# EAGLE design alt (EAGLE 6.5.0)
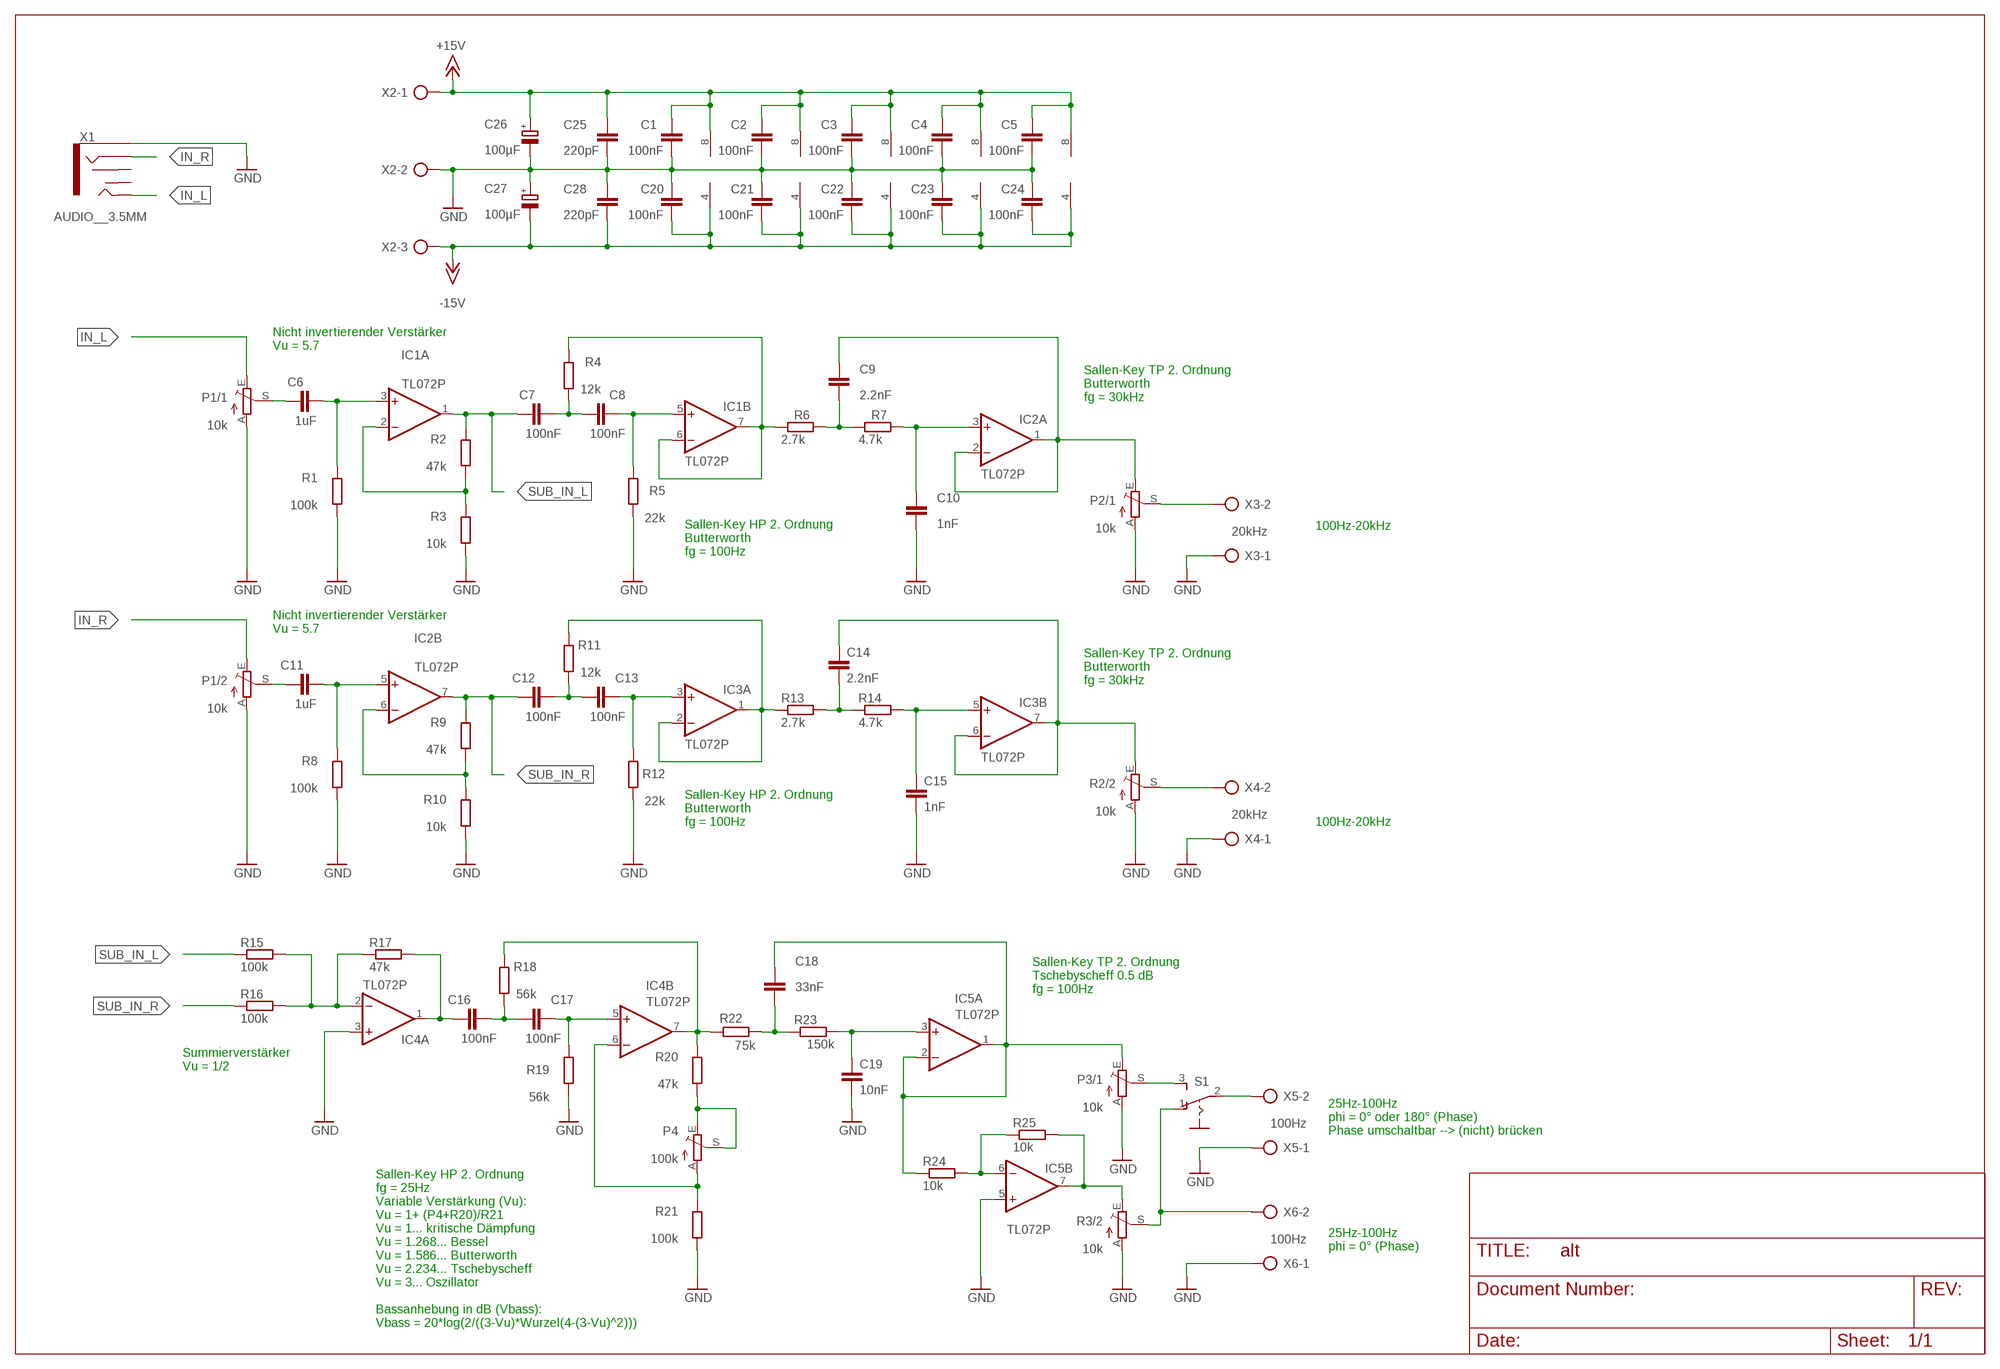
[diagram p0: schematic, sheet 1]

## Parts
C1  100nF  C-EU025-025X050  [C025-025X050]
C2  100nF  C-EU025-025X050  [C025-025X050]
C3  100nF  C-EU025-025X050  [C025-025X050]
C4  100nF  C-EU025-025X050  [C025-025X050]
C5  100nF  C-EU025-025X050  [C025-025X050]
C6  1uF  C-EU025-025X050  [C025-025X050]
C7  100nF  C-EU025-025X050  [C025-025X050]
C8  100nF  C-EU025-025X050  [C025-025X050]
C9  2.2nF  C-EU025-025X050  [C025-025X050]
C10  1nF  C-EU025-025X050  [C025-025X050]
C11  1uF  C-EU025-025X050  [C025-025X050]
C12  100nF  C-EU025-025X050  [C025-025X050]
C13  100nF  C-EU025-025X050  [C025-025X050]
C14  2.2nF  C-EU025-025X050  [C025-025X050]
C15  1nF  C-EU025-025X050  [C025-025X050]
C16  100nF  C-EU050-025X075  [C050-025X075]
C17  100nF  C-EU025-025X050  [C025-025X050]
C18  33nF  C-EU025-025X050  [C025-025X050]
C19  10nF  C-EU025-025X050  [C025-025X050]
C20  100nF  C-EU025-025X050  [C025-025X050]
C21  100nF  C-EU025-025X050  [C025-025X050]
C22  100nF  C-EU025-025X050  [C025-025X050]
C23  100nF  C-EU025-025X050  [C025-025X050]
C24  100nF  C-EU025-025X050  [C025-025X050]
C25  220pF  C-EU025-025X050  [C025-025X050]
C26  100µF  CPOL-EUE2.5-6  [E2,5-6]
C27  100µF  CPOL-EUE2.5-6  [E2,5-6]
C28  220pF  C-EU025-025X050  [C025-025X050]
IC1  TL072P  [DIL08]
IC2  TL072P  [DIL08]
IC3  TL072P  [DIL08]
IC4  TL072P  [DIL08]
IC5  TL072P  [DIL08]
P1/1  10k  TRIM_EU-B64Y  [B64Y]
P1/2  10k  TRIM_EU-B64Y  [B64Y]
P2/1  10k  TRIM_EU-B64Y  [B64Y]
P3/1  10k  TRIM_EU-B64Y  [B64Y]
P4  100k  TRIM_EU-B64Y  [B64Y]
R1  100k  R-EU_0207/10  [0207/10]
R2  47k  R-EU_0207/10  [0207/10]
R2/2  10k  TRIM_EU-B64Y  [B64Y]
R3  10k  R-EU_0207/10  [0207/10]
R3/2  10k  TRIM_EU-B64Y  [B64Y]
R4  12k  R-EU_0207/10  [0207/10]
R5  22k  R-EU_0207/10  [0207/10]
R6  2.7k  R-EU_0207/10  [0207/10]
R7  4.7k  R-EU_0207/10  [0207/10]
R8  100k  R-EU_0207/7  [0207/7]
R9  47k  R-EU_0207/7  [0207/7]
R10  10k  R-EU_0207/10  [0207/10]
R11  12k  R-EU_0207/10  [0207/10]
R12  22k  R-EU_0207/10  [0207/10]
R13  2.7k  R-EU_0207/10  [0207/10]
R14  4.7k  R-EU_0207/10  [0207/10]
R15  100k  R-EU_0207/10  [0207/10]
R16  100k  R-EU_0207/10  [0207/10]
R17  47k  R-EU_0207/10  [0207/10]
R18  56k  R-EU_0207/10  [0207/10]
R19  56k  R-EU_0207/7  [0207/7]
R20  47k  R-EU_0207/10  [0207/10]
R21  100k  R-EU_0207/10  [0207/10]
R22  75k  R-EU_0207/7  [0207/7]
R23  150k  R-EU_0207/10  [0207/10]
R24  10k  R-EU_0207/10  [0207/10]
R25  10k  R-EU_0207/10  [0207/10]
S1  255SB  [255SB]
X1  AUDIO__3.5MM  AUDIO_JACK_3.5MM_PTH  [AUDIO-JACK]
X2  AK300/3  [AK300/3]
X3  20kHz  AK300/2  [AK300/2]
X4  20kHz  AK300/2  [AK300/2]
X5  100Hz  AK300/2  [AK300/2]
X6  100Hz  AK300/2  [AK300/2]

## Nets
+15V: C1.1 C2.1 C3.1 C4.1 C5.1 C25.1 C26.+ IC1.8(P:V+) IC2.8(P:V+) IC3.8(P:V+) IC4.8(P:V+) IC5.8(P:V+) X2.1
-15V: C20.2 C21.2 C22.2 C23.2 C24.2 C27.- C28.2 IC1.4(P:V-) IC2.4(P:V-) IC3.4(P:V-) IC4.4(P:V-) IC5.4(P:V-) X2.3
GND: C1.2 C2.2 C3.2 C4.2 C5.2 C10.2 C15.2 C19.2 C20.1 C21.1 C22.1 C23.1 C24.1 C25.2 C26.- C27.+ C28.1 IC4.3(A:+IN) IC5.5(B:+IN) P1/1.A P1/2.A P2/1.A P3/1.A R1.1 R2/2.A R3.1 R3/2.A R5.1 R8.1 R10.1 R12.1 R19.1 R21.1 X1.SLEEVE X2.2 X3.1 X4.1 X5.1 X6.1
IN_L: P1/1.E X1.TIP
IN_R: P1/2.E X1.RING
N$1: P3/1.S S1.3(S)
N$2: R3/2.S S1.1(O) X6.2
N$3: S1.2(P) X5.2
N$26: C6.1 P1/1.S
N$28: C6.2 IC1.3(A:+IN) R1.2
N$31: IC1.2(A:-IN) R2.1 R3.2
N$33: IC1.6(B:-IN) IC1.7(B:OUT) R4.2 R6.1
N$34: C8.2 IC1.5(B:+IN) R5.2
N$35: C7.2 C8.1 R4.1
N$36: IC4.2(A:-IN) R15.2 R16.2 R17.1
N$37: C9.2 R6.2 R7.1
N$38: C10.1 IC2.3(A:+IN) R7.2
N$39: C9.1 IC2.1(A:OUT) IC2.2(A:-IN) P2/1.E
N$40: C16.1 IC4.1(A:OUT) R17.2
N$41: C11.1 P1/2.S
N$42: C11.2 IC2.5(B:+IN) R8.2
N$43: IC2.6(B:-IN) R9.1 R10.2
N$45: IC3.1(A:OUT) IC3.2(A:-IN) R11.2 R13.1
N$46: C13.2 IC3.3(A:+IN) R12.2
N$47: C12.2 C13.1 R11.1
N$48: C14.2 R13.2 R14.1
N$49: C15.1 IC3.5(B:+IN) R14.2
N$50: C14.1 IC3.6(B:-IN) IC3.7(B:OUT) R2/2.E
N$51: C16.2 C17.1 R18.1
N$52: C17.2 IC4.5(B:+IN) R19.2
N$53: IC4.7(B:OUT) R18.2 R20.2 R22.2
N$54: IC4.6(B:-IN) P4.A R21.2
N$55: IC5.6(B:-IN) R24.2 R25.1
N$57: P4.E P4.S R20.1
N$59: C19.1 IC5.3(A:+IN) R23.2
N$60: C18.2 R22.1 R23.1
OUT_L: P2/1.S X3.2
OUT_R: R2/2.S X4.2
SUB_IN_L: C7.1 IC1.1(A:OUT) R2.2 R15.1
SUB_IN_R: C12.1 IC2.7(B:OUT) R9.2 R16.1
SUB_OUT: IC5.7(B:OUT) R3/2.E R25.2
SUB_OUT-180: C18.1 IC5.1(A:OUT) IC5.2(A:-IN) P3/1.E R24.1
Unconnected: X1.RSH X1.TSH

## Notes on the sheet
- Nicht invertierender Verstärker
  Vu = 5.7
- Sallen-Key TP 2. Ordnung
  Butterworth
  fg = 30kHz
- 100Hz-20kHz
- Sallen-Key HP 2. Ordnung
  Butterworth
  fg = 100Hz
- Nicht invertierender Verstärker
  Vu = 5.7
- Sallen-Key TP 2. Ordnung
  Butterworth
  fg = 30kHz
- Sallen-Key HP 2. Ordnung
  Butterworth
  fg = 100Hz
- 100Hz-20kHz
- Sallen-Key TP 2. Ordnung
  Tschebyscheff 0.5 dB
  fg = 100Hz
- Summierverstärker
  Vu = 1/2
- 25Hz-100Hz
  phi = 0° oder 180° (Phase) 
  Phase umschaltbar --> (nicht) brücken
- 25Hz-100Hz
  phi = 0° (Phase)
- Sallen-Key HP 2. Ordnung
  fg = 25Hz
  Variable Verstärkung (Vu): 
  Vu = 1+ (P4+R20)/R21
  Vu = 1... kritische Dämpfung
  Vu = 1.268... Bessel
  Vu = 1.586... Butterworth
  Vu = 2.234... Tschebyscheff
  Vu = 3... Oszillator
  
  Bassanhebung in dB (Vbass):
  Vbass = 20*log(2/((3-Vu)*Wurzel(4-(3-Vu)^2)))

## Library data of the parts
C1-C5 C16-C25 C28 = rcl:C-EU: CAPACITOR, European symbol
C6-C15 = resistor:C-EU: CAPACITOR, European symbol
C26 C27 = rcl:CPOL-EU: POLARIZED CAPACITOR, European symbol
IC1-IC5 = linear:TL072: OP AMP
P1/1 P1/2 P2/1 P3/1 P4 R2/2 R3/2 = pot:TRIM_EU-: POTENTIOMETER
R1-R7 R10-R14 = resistor:R-EU_: RESISTOR, European symbol
R8 R9 R15-R25 = rcl:R-EU_: RESISTOR, European symbol
S1 = switch:255SB: SLIDING SWITCH Distributor Buerklin, 11G810
X1 = SparkFun-Connectors:AUDIO_JACK_3.5MM: Audio Jack 3.5mm variants of PTH and SMT stereo audio jack with bypass switches. SparkFun Products: SparkFun SparkPunk Sound Kit <[https://www.sparkfun.com/products/11177]> - PTH MP3 Trigger <https://www.sparkfun.com/products/13720> -3.5mm SMD SparkFun PicoBoard <https://www.sparkfun.com/products/11888>- 2.5mm SMD; PROD_ID: CONN-08774; SF_ID: PRT-08032
X2 = con-ptr500:AK300/3: CONNECTOR; OC_FARNELL: unknown; OC_NEWARK: unknown
X3-X6 = con-ptr500:AK300/2: CONNECTOR; OC_FARNELL: unknown; OC_NEWARK: unknown

## Board
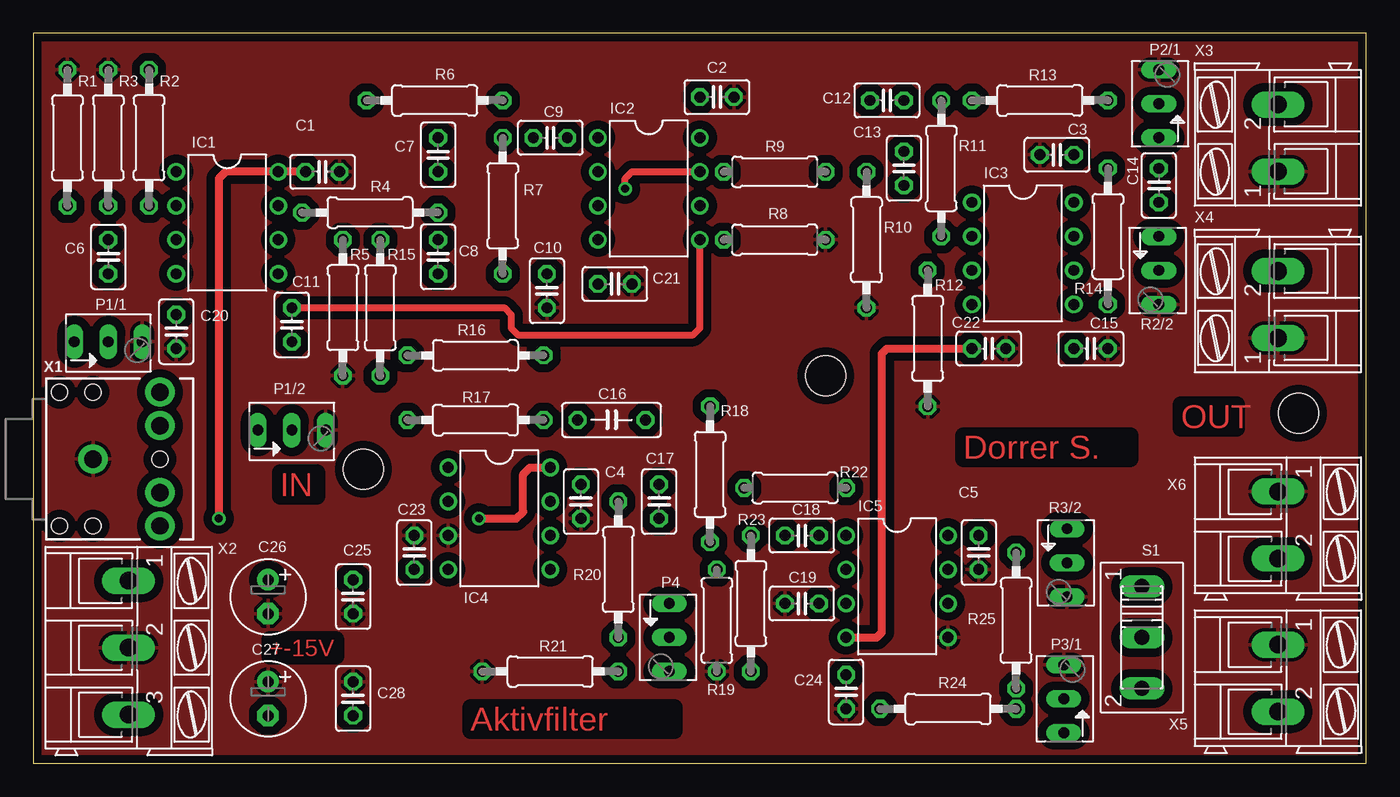
[diagram p1: board, top side]
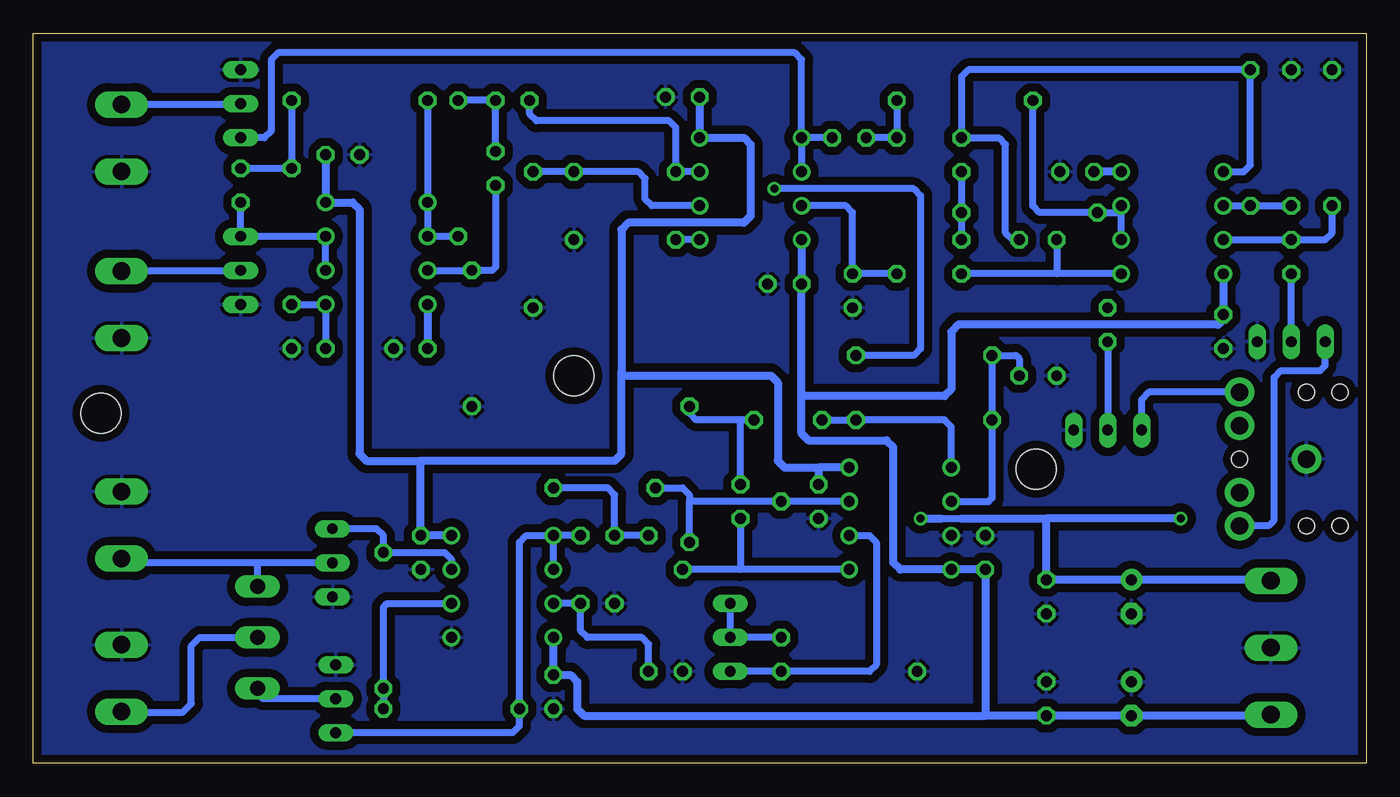
[diagram p2: board, bottom side, seen from below]

Size 99.55 x 54.53 mm. Coordinates in mm from the lower left corner, seen from the top.
Outline: 0,0 99.55,0 99.55,54.53 0,54.53 0,0
Copper layers (1*16): Top 0.035mm / dielectric 1.5mm / Bottom 0.035mm
Design rules "default *": minimum track width 10mil, minimum drill 20mil, track to track 8mil, track to pad 8mil, pad to pad 8mil, via to via 8mil, smd to smd 8mil, copper to edge 20mil, drill to drill 8mil, minimum pad ring 10mil, minimum via ring 8mil, stop-mask expansion 4mil, vias tented up to drill 0mil, thermal gap 10mil
Holes 3 mm at 59.18,28.96 24.64,21.97 94.49,26.16

### Footprints (pad centres in the part's own frame; a part is rotated, then mirrored left to right if it is on the bottom)
C025-025X050 = drill 0.813 octagon: 1 -1.27,0; 2 1.27,0
C050-025X075 = drill 0.813 octagon: 1 -2.54,0; 2 2.54,0
E2,5-6 = drill 0.813 pad 1.6: + -1.27,0 | drill 0.813 pad 1.6 octagon: - 1.27,0
DIL08 = drill 0.813 pad 1.27: 1 -3.81,-3.81; 2 -1.27,-3.81; 3 1.27,-3.81; 4 3.81,-3.81; 5 3.81,3.81; 6 1.27,3.81; 7 -1.27,3.81; 8 -3.81,3.81
B64Y = drill 0.813 long: A 2.54,0; E -2.54,0; S 0,0
0207/10 = drill 0.813 octagon: 1 -5.08,0; 2 5.08,0
0207/7 = drill 0.813 octagon: 1 -3.81,0; 2 3.81,0
255SB = drill 1.118 long: 1 -3.81,0; 2 0,0; 3 3.81,0
AUDIO-JACK = drill 1.3 pad 2.184: RING 5,5; RSH 5,2.5; SLEEVE 0,0; TIP 5,-5; TSH 5,-2.5 | hole 1.2: 0,5; -2.5,5; -2.5,-5; 0,-5; 5,0
AK300/3 = drill 1.321 long: 1 -5.004,0; 2 0,0; 3 5.004,0
AK300/2 = drill 1.321 long: 1 -2.515,0; 2 2.489,0

### Placement (x,y rotation side)
C1  21.59,44.2 0 top
C2  51.05,49.78 0 top
C3  76.45,45.47 180 top
C4  40.89,19.56 270 top
C5  70.61,15.75 270 top
C6  5.59,37.85 90 top
C7  30.23,45.47 270 top
C8  30.23,37.85 270 top
C9  38.61,46.74 180 top
C10  38.35,35.31 270 top
C11  19.3,32.77 90 top
C12  63.75,49.53 0 top
C13  65.02,44.45 270 top
C14  84.07,43.18 90 top
C15  78.99,30.99 0 top
C16  43.18,25.65 0 top
C17  46.74,19.56 270 top
C18  57.4,17.02 180 top
C19  57.4,11.94 180 top
C20  10.67,32.26 90 top
C21  43.43,35.81 180 top
C22  71.37,30.99 180 top
C23  28.45,15.75 270 top
C24  60.71,5.33 90 top
C25  23.88,12.45 270 top
C26  17.53,12.45 270 top
C27  17.53,4.83 270 top
C28  23.88,4.83 270 top
IC1  14.48,40.39 270 top
IC2  45.97,42.93 270 top
IC3  73.91,38.1 270 top
IC4  34.8,18.29 270 top
IC5  64.52,13.21 270 top
P1/1  5.59,31.5 0 top
P1/2  19.3,24.89 0 top
P2/1  84.07,49.28 90 top
P3/1  76.96,4.83 90 top
P4  47.5,9.4 270 top
R1  2.54,46.74 270 top
R2  8.64,46.74 90 top
R2/2  84.07,36.83 270 top
R3  5.59,46.74 270 top
R3/2  77.22,14.99 270 top
R4  25.15,41.15 180 top
R5  23.11,34.04 90 top
R6  29.97,49.53 0 top
R7  35.05,41.66 270 top
R8  55.37,39.12 180 top
R9  55.37,44.2 180 top
R10  62.23,39.12 90 top
R11  67.82,44.45 270 top
R12  66.8,31.75 90 top
R13  75.18,49.53 0 top
R14  80.26,39.37 270 top
R15  25.91,34.04 270 top
R16  33.02,30.48 180 top
R17  33.02,25.65 0 top
R18  50.55,21.59 270 top
R19  51.05,10.67 90 top
R20  43.69,14.48 90 top
R21  38.61,6.86 0 top
R22  56.9,20.57 180 top
R23  53.59,11.94 270 top
R24  68.33,4.06 0 top
R25  73.41,10.67 90 top
S1  82.8,9.4 270 top
X1  4.45,22.73 0 top
X2  7.11,8.64 270 top
X3  92.96,46.74 90 top
X4  92.96,34.29 90 top
X5  92.96,6.35 270 top
X6  92.96,17.78 270 top

### Tracks (layer width: path | path; a pad name or v marks a point on that pad's centre or on a via)
+15V  (via drill 0.6)
  Top 0.61: IC4.8 37.08,22.1 36.58,21.59 36.58,18.8 36.07,18.29 v33.27,18.29 | C1.1 14.35,44.2 13.84,43.69 v13.84,18.29
  Bottom 0.508: 31.75,18.29 30.23,18.29
  Bottom 0.61: IC5.8 C5.1 70.61,22.61 | C3.1 IC3.8 75.69,41.91 75.18,41.4 75.18,23.11 74.68,22.61 70.61,22.61 | IC1.8 C1.1 | C2.1 IC2.8 46.48,46.74 45.97,46.23 45.97,40.89 46.48,40.39 55.12,40.39 55.63,39.88 55.63,29.21 | 70.61,22.61 56.13,22.61 55.63,23.11 55.63,29.21 | IC4.8 40.89,22.1 | 40.89,22.1 C4.1 | 55.63,29.21 55.37,28.96 44.45,28.96 43.94,28.45 43.94,22.61 43.43,22.1 40.89,22.1 | 23.88,18.29 C25.1 C26.+ 7.19,13.72 X2.1 | v13.84,18.29 23.88,18.29 | v33.27,18.29 31.75,18.29 | 30.23,18.29 23.88,18.29
-15V
  Top 0.61: IC5.4 62.99,9.4 63.37,9.78 63.37,30.61 63.75,30.99 C22.2
  Bottom 0.61: IC5.4 C24.2 59.44,6.6 58.93,6.1 58.93,4.06 58.42,3.56 28.45,3.56 | IC3.4 C22.2 | IC1.4 C20.2 10.67,33.15 11.05,32.77 30.48,32.77 30.99,32.26 30.99,27.94 31.5,27.43 42.16,27.43 | IC2.4 C21.2 42.16,27.43 | 28.45,3.56 C23.2 IC4.4 34.8,14.48 35.31,14.99 35.31,23.62 35.81,24.13 41.66,24.13 42.16,24.64 42.16,27.43 | 28.45,3.56 C28.2 C27.- 7.19,3.56 X2.3
GND
  pour Bottom (isolate 0.61): 0,0 0,54.61 99.57,54.61 99.57,0
  pour Top (isolate 0.61): 0,0 0,54.61 99.57,54.61 99.57,0
IN_L
  Bottom 0.508: X1.TIP 9.4,17.78 7.24,17.78 6.86,18.16 6.86,28.83 6.35,29.34 3.43,29.34 3.05,29.72 P1/1.E
IN_R
  Bottom 0.508: P1/2.E 16.76,27.18 16.18,27.76 9.45,27.76 X1.RING
N$1
  Bottom 0.508: P3/1.S 82.42,4.83 82.8,5.21 S1.3
N$2
  Bottom 0.508: R3/2.S 82.8,14.99 | 82.8,14.99 92.66,14.99 X6.2 | S1.1 82.8,14.99
N$3
  Bottom 0.508: X5.2 92.91,3.81 88.39,3.81 87.76,4.45 87.76,8.76 87.12,9.4 S1.2
N$26
  Bottom 0.508: P1/1.S C6.1
N$28
  Bottom 0.508: IC1.3 C6.2 3.05,39.12 2.54,39.62 R1.2
N$31
  Bottom 0.508: IC1.2 R2.1 R3.2
N$33
  Bottom 0.508: IC1.6 18.29,41.15 | 18.29,41.15 IC1.7 | 18.29,41.15 R4.2 24.38,41.15 24.89,41.66 R6.1
N$34
  Bottom 0.508: IC1.5 23.11,36.58 | 23.11,36.58 C8.2 | R5.2 23.11,36.58
N$35
  Bottom 0.508: C7.2 R4.1 C8.1
N$36
  Bottom 0.508: IC4.2 28.19,19.56 27.94,19.81 R17.1 R16.2 26.16,30.48 25.91,30.23 R15.2
N$37
  Bottom 0.508: R6.2 R7.1 C9.2
N$38
  Bottom 0.508: IC2.3 38.86,41.66 38.35,41.15 C10.1 R7.2
N$39
  Bottom 0.508: C9.1 IC2.1 | IC2.1 IC2.2 | IC2.1 42.16,52.58 42.67,53.09 81.28,53.09 81.79,52.58 81.79,47.24 82.3,46.74 P2/1.E
N$40
  Bottom 0.508: IC4.1 30.99,25.15 31.5,25.65 R17.2 C16.1
N$41
  Bottom 0.508: C11.1 P1/2.S
N$42
  Top 0.508: C11.2 35.18,34.04 35.69,33.53 35.69,32.51 36.2,32 49.28,32 49.78,32.51 IC2.5
  Bottom 0.508: IC2.5 R8.2
N$43
  Bottom 0.508: IC2.6 53.34,41.66 53.85,42.16 53.85,43.69 54.36,44.2 R9.1 R10.2
N$45
  Bottom 0.508: R11.2 IC3.2 IC3.1 R13.1
N$46
  Bottom 0.508: IC3.3 R12.2 65.28,36.83 65.02,37.08 C13.2
N$47
  Bottom 0.508: R11.1 C12.2 C13.1
N$48
  Bottom 0.508: C14.2 R14.1 R13.2
N$49
  Bottom 0.508: C15.1 IC3.5 R14.2
N$50
  Bottom 0.508: C14.1 R2/2.E IC3.7 IC3.6
N$51
  Bottom 0.508: C16.2 46.74,25.65 | 46.74,25.65 50.04,25.65 50.55,26.16 R18.1 | C17.1 46.74,25.65
N$52
  Bottom 0.508: C17.2 46.74,14.48 | IC4.5 46.74,14.48 | 46.74,14.48 R19.2
N$53
  Bottom 0.508: IC4.7 R20.2 50.55,19.56 | R18.2 50.55,19.56 | R22.2 51.05,20.57 50.55,20.07 50.55,19.56
N$54
  Bottom 0.508: P4.A R21.2 37.08,6.86 36.58,7.37 36.58,16.51 37.08,17.02 IC4.6
N$55
  Bottom 0.508: IC5.6 73.15,11.94 73.41,11.68 R25.1 R24.2
N$57
  Bottom 0.508: P4.E P4.S R20.1
N$59
  Bottom 0.508: IC5.3 C19.1 58.67,9.91 58.17,9.4 54.1,9.4 53.59,8.89 R23.2
N$60
  Bottom 0.508: R23.1 C18.2 56.13,20.07 56.64,20.57 R22.1
OUT_L
  Bottom 0.508: P2/1.S 84.12,49.23 X3.2
OUT_R
  Bottom 0.508: R2/2.S 84.12,36.78 X4.2
SUB_IN_L
  Bottom 0.508: IC1.1 9.14,44.2 8.64,44.7 R2.2 29.72,51.82 30.23,51.31 C7.1 27.43,46.74 26.92,46.23 26.92,39.62 26.42,39.12 R15.1
SUB_IN_R  (via drill 0.6)
  Top 0.508: v44.2,42.93 44.2,43.69 44.7,44.2 IC2.7
  Bottom 0.508: IC2.7 R9.2 51.56,47.5 52.07,48.01 61.98,48.01 62.48,48.51 C12.1 | R16.1 33.78,30.48 33.27,30.99 33.27,42.42 33.78,42.93 v44.2,42.93
SUB_OUT
  Bottom 0.508: R3/2.E 73.91,17.53 73.41,17.02 R25.2 68.83,15.75 68.33,15.24 IC5.7
SUB_OUT-180
  Bottom 0.508: C18.1 IC5.1 | IC5.2 IC5.1 | P3/1.E 63.75,2.29 63.25,2.79 R24.1 63.25,16.51 62.74,17.02 IC5.1

### Text on the board
Top: OUT | Dorrer S. | IN | +-15V | Aktivfilter